# EAGLE design Payload_exterior v1.0 (EAGLE 6.2)
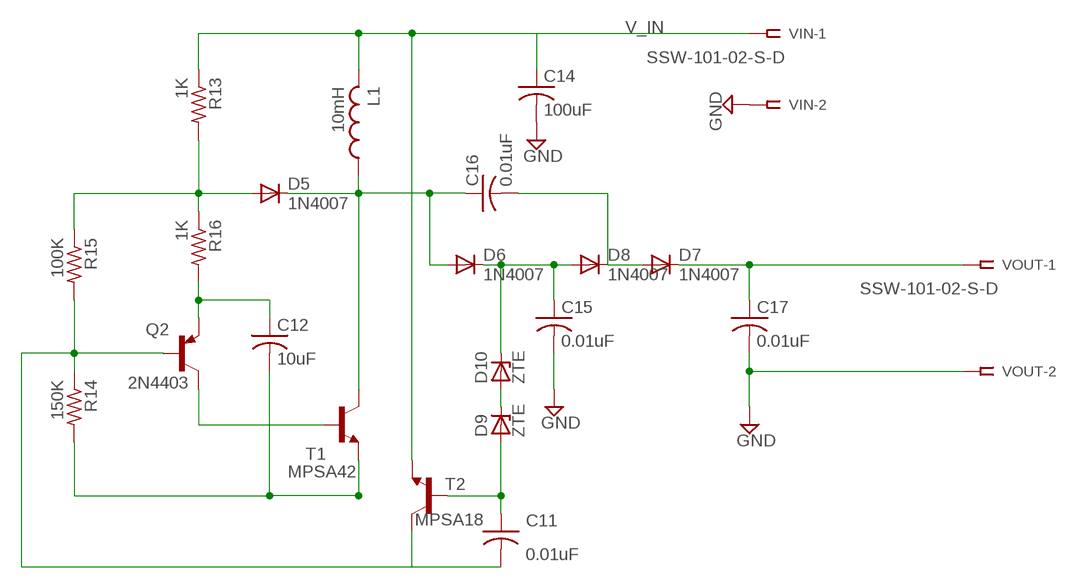
[diagram p0: schematic, sheet 1]

## Parts
C11  0.01uF  C-US050-035X075  [C050-035X075]
C12  10uF  C-US050-035X075  [C050-035X075]
C14  100uF  C-US050-035X075  [C050-035X075]
C15  0.01uF  C-US050-035X075  [C050-035X075]
C16  0.01uF  C-US050-035X075  [C050-035X075]
C17  0.01uF  C-US050-035X075  [C050-035X075]
D5  1N4007  1N4004  [DO41-10]
D6  1N4007  1N4004  [DO41-10]
D7  1N4007  1N4004  [DO41-10]
D8  1N4007  1N4004  [DO41-10]
D9  ZTE  [DO35Z10]
D10  ZTE  [DO35Z10]
L1  10mH  L-US0207/12  [0207/12]
Q2  2N4403  2N4126  [TO92-CBE]
R13  1K  R-US_0207/12  [0207/12]
R14  150K  R-US_0207/12  [0207/12]
R15  100K  R-US_0207/12  [0207/12]
R16  1K  R-US_0207/12  [0207/12]
T1  MPSA42  2SC458  [TO92-ECB]
T2  MPSA18  2SC458  [TO92-ECB]
VIN  SSW-101-02-S-D  [SSW-101-02-S-D]
VOUT  SSW-101-02-S-D  [SSW-101-02-S-D]

## Nets
GND: C14.2 C15.2 C17.2 VIN.2 VOUT.2
N$12: C12.1 Q2.E R16.2
N$31: C11.2 Q2.B R14.1 R15.2 T2.C
N$32: D5.A R13.2 R15.1 R16.1
N$34: C16.1 D5.C D6.A L1.1 T1.C
N$35: C12.2 R14.2 T1.E
N$36: C15.1 D6.C D8.A D10.C
N$37: C16.2 D7.A D8.C
N$38: C17.1 D7.C VOUT.1
N$39: Q2.C T1.B
N$40: C11.1 D9.A T2.B
N$41: D9.C D10.A
V_IN: C14.1 L1.2 R13.1 T2.E VIN.1

## Library data of the parts
C11 C12 C14-C17 = resistor:C-US: CAPACITOR, American symbol
D5-D8 = diode:1N4004: DIODE general purpose rectifier, 1 A
D9 D10 = diode:ZTE: Z DIODE 300 mW
L1 = rcl:L-US: INDUCTOR, American symbol
Q2 = transistor-pnp:2N4126*: PNP Transistror
R13-R16 = rcl:R-US_: RESISTOR, American symbol
T1 T2 = transistor:2SC458: NPN Silicon Epitaxial Planar Transistor Source: SEMTECH ELECTRONICS LTD. ... 2SC458 1.pdf
VIN VOUT = con-samtec:SSW-101-02-S-D: THROUGH-HOLE .025" SQ POST SOCKET Source: Samtec SSW.pdf; MPN: SSW-101-02-S-D; OC_FARNELL: unknown; OC_NEWARK: 82P1456

## Net classes
0 default: width 0.406 mm

## Board
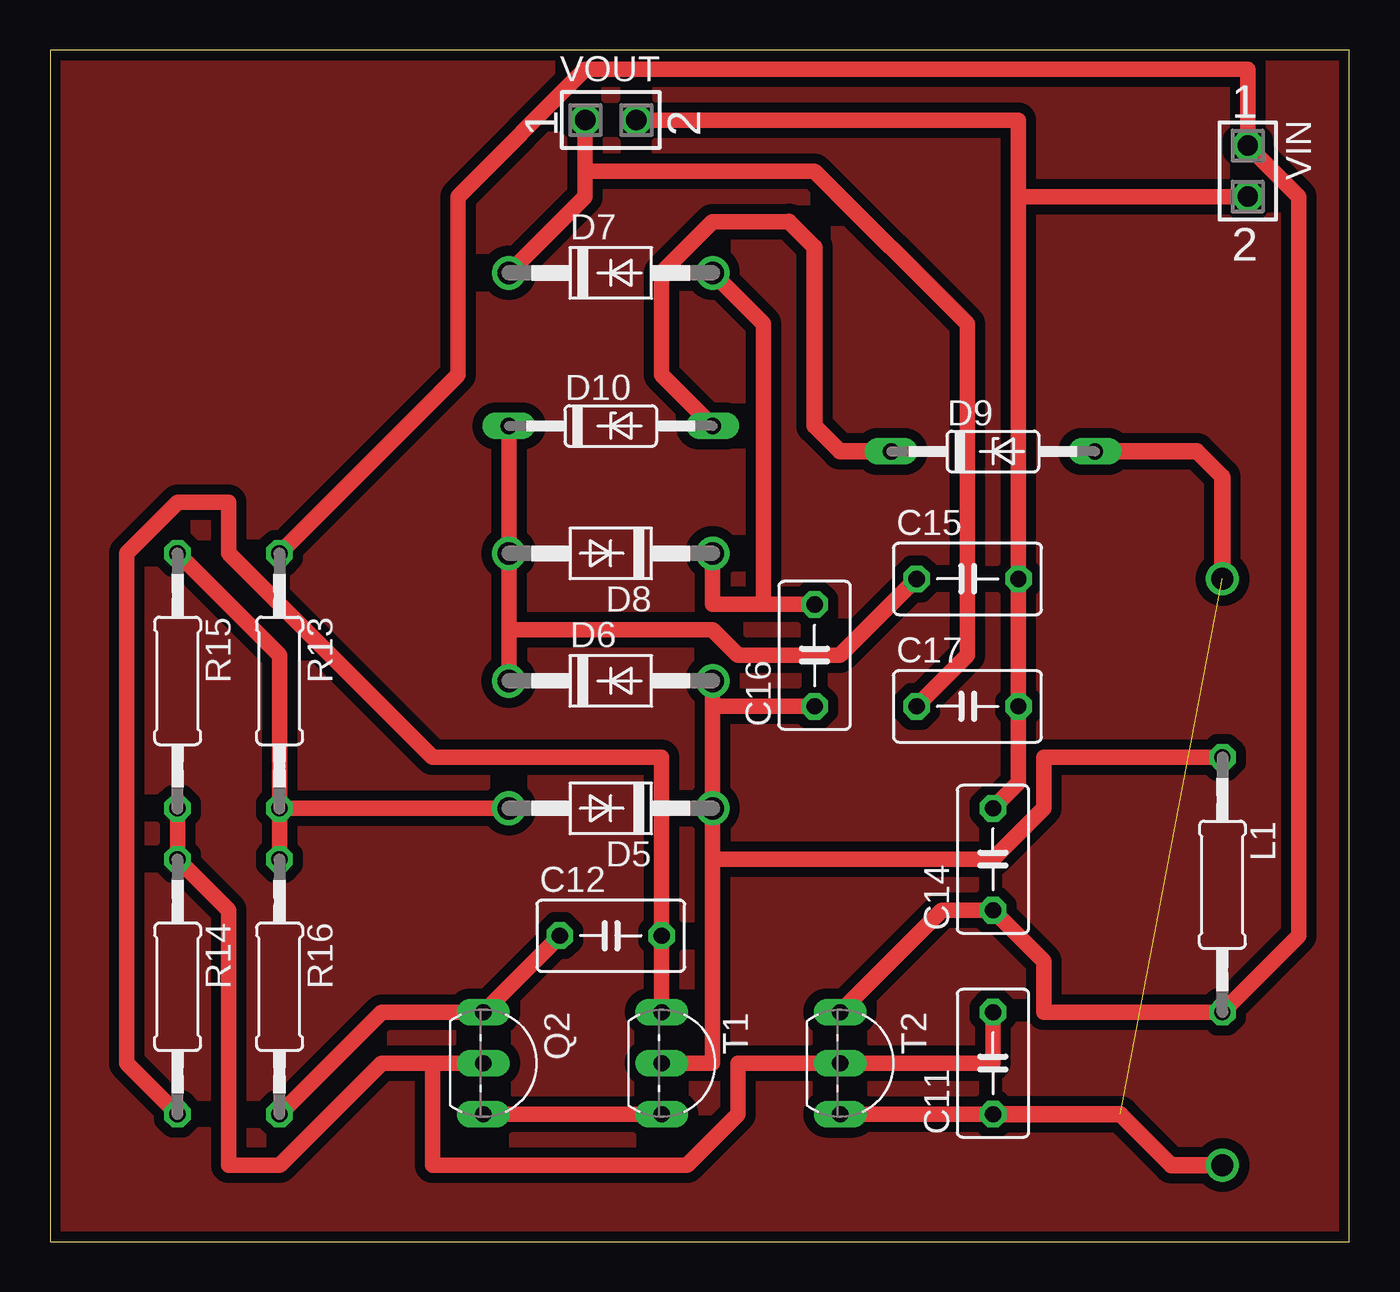
[diagram p1: board, top side]

Size 64.75 x 59.36 mm. Coordinates in mm from the lower left corner, seen from the top.
Outline: 0,0 64.75,0 64.75,59.36 0,59.36 0,0
Copper layers (1*16): Top 0.035mm / dielectric 1.5mm / Bottom 0.035mm
Design rules: minimum track width 30mil, minimum drill 24mil, track to track 20mil, track to pad 20mil, pad to pad 20mil, via to via 20mil, smd to smd 20mil, copper to edge 20mil, drill to drill 8mil, minimum pad ring 10mil, minimum via ring 8mil, stop-mask expansion 4mil, vias tented up to drill 0mil, thermal gap 10mil

### Footprints (pad centres in the part's own frame; a part is rotated, then mirrored left to right if it is on the bottom)
C050-035X075 = drill 0.813 octagon: 1 -2.54,0; 2 2.54,0
DO41-10 = drill 1.118: A 5.08,0; C -5.08,0
DO35Z10 = drill 0.813 long: A 5.08,0; C -5.08,0
0207/12 = drill 0.813 octagon: 1 -6.35,0; 2 6.35,0
TO92-CBE = drill 0.813 long: B 0,0; C 2.54,0; E -2.54,0
TO92-ECB = drill 0.813 long: B 2.54,0; C 0,0; E -2.54,0
SSW-101-02-S-D = drill 1 pad 1.5 octagon: 1 0,-1.27; 2 0,1.27

### Placement (x,y rotation side)
C11  46.99,8.89 90 top
C12  27.94,15.24 0 top
C14  46.99,19.05 90 top
C15  45.72,33.02 0 top
C16  38.1,29.21 90 top
C17  45.72,26.67 0 top
D5  27.94,21.59 180 top
D6  27.94,27.94 0 top
D7  27.94,48.26 0 top
D8  27.94,34.29 180 top
D9  46.99,39.37 0 top
D10  27.94,40.64 0 top
L1  58.42,17.78 270 top
Q2  21.59,8.89 270 top
R13  11.43,27.94 270 top
R14  6.35,12.7 270 top
R15  6.35,27.94 270 top
R16  11.43,12.7 270 top
T1  30.48,8.89 270 top
T2  39.37,8.89 270 top
VIN  59.69,53.34 180 top
VOUT  27.94,55.88 270 top

### Tracks (layer width: path | path; a pad name or v marks a point on that pad's centre or on a via)
FILL
  pour Top: 0,59.69 64.77,59.69 64.77,0 0,0
GND
  Top 0.762: C14.2 48.26,22.86 C17.2 C15.2 48.26,52.07 | VOUT.2 48.26,55.88 48.26,52.07 | 48.26,52.07 VIN.2
N$12
  Top 0.762: R16.2 16.51,11.43 Q2.E C12.1
N$31
  Top 0.762: C11.2 46.99,8.89 T2.C 34.29,8.89 34.29,6.35 31.75,3.81 19.05,3.81 19.05,8.89 | R15.2 R14.1 8.89,16.51 8.89,3.81 11.43,3.81 16.51,8.89 19.05,8.89 | 19.05,8.89 Q2.B
N$32
  Top 0.762: R13.2 R16.1 | R15.1 11.43,29.21 R13.2 | R13.2 D5.A
N$34
  Top 0.762: 33.02,26.67 C16.1 | D6.A 33.02,26.67 | T1.C 33.02,8.89 33.02,19.05 | 33.02,19.05 D5.C 33.02,26.67 | L1.1 49.53,24.13 49.53,21.59 46.99,19.05 33.02,19.05
N$35
  Top 0.762: R14.2 3.81,8.89 3.81,34.29 6.35,36.83 8.89,36.83 8.89,34.29 19.05,24.13 30.48,24.13 C12.2 T1.E
N$36
  Top 0.762: D10.C D8.A 22.86,30.48 | C15.1 39.37,29.21 34.29,29.21 33.02,30.48 22.86,30.48 | D6.C 22.86,30.48
N$37
  Top 0.762: 35.56,31.75 33.02,31.75 D8.C | 35.56,31.75 C16.2 | D7.A 35.56,45.72 35.56,31.75
N$38
  Top 0.762: C17.1 45.72,29.21 45.72,45.72 38.1,53.34 26.67,53.34 | VOUT.1 26.67,53.34 | D7.C 26.67,52.07 26.67,53.34
N$39
  Top 0.762: T1.B Q2.C
N$40  (via drill 1.1)  (1 unrouted)
  Top 0.762: C11.1 T2.B
  Top 0.813: D9.A 57.15,39.37 58.42,38.1 v58.42,33.02 | C11.1 53.34,6.35 55.88,3.81 v58.42,3.81
N$41
  Top 0.762: D10.A 30.48,43.18 30.48,48.26 33.02,50.8 36.83,50.8
  Top 0.813: 36.83,50.8 38.1,49.53 38.1,40.64 39.37,39.37 D9.C
V_IN
  Top 0.762: T2.E 44.45,16.51 C14.1 49.53,13.97 49.53,11.43 L1.2 62.23,15.24 62.23,52.07 VIN.1 59.69,58.42 26.67,58.42 20.32,52.07 20.32,43.18 R13.1